# Altium schematic sheet POWER.SchDoc
size A4; SheetNumber: 2; SheetTotal: 4
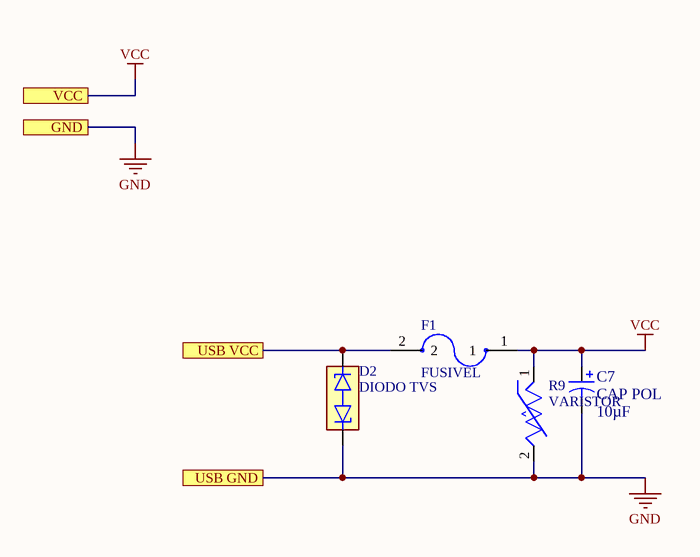
[diagram p0: POWER.SchDoc]

## Parts
C7  CAP POL  value 10µF  [CONDENS 10uF]
D2  DIODO TVS  [DIODO TVS]
F1  FUSIVEL  [FUSIVEL ARMADO 0.5A]
R9  VARISTOR  [VARISTOR]

## Ports
GND, USB GND, USB VCC, VCC

## Nets
GND: C7.2 D2.1 R9.2 ; port GND, port USB GND
VCC: C7.1 F1.1 R9.1 ; port VCC
USB VCC: D2.2 F1.2 ; port USB VCC

## Library data of the parts
C7 = Cap Pol2: Polarized Capacitor (Axial); Published: 8-Jun-2000; LatestRevisionDate: 17-Jul-2002; LatestRevisionNote: Re-released for DXP Platform.; PackageReference: POLAR0.8; Publisher: Altium Limited; PackageDescription: Polarized Capacitor; 2 Leads
D2 = DIODO TVS: 1 Amp General Purpose Rectifier; Published: 8-Jun-2000; LatestRevisionDate: 17-Jul-2002; LatestRevisionNote: Re-released for DXP Platform.; DatasheetVersion: 1998; PackageVersion: Aug-1999; PackageReference: DO-41; Publisher: Altium Limited; PackageDescription: Diode, Axial; Body 5.2 x 2.7 mm (LxDia. max), Lead Dia. 0.86 mm (max); Code_JEDEC: DO-204-AL; ComponentLink1Description: Manufacturer Link; ComponentLink1URL: http://www.fairchildsemi.com/; ComponentLink2Description: Datasheet; ComponentLink2URL: http://www.fairchildsemi.com/ds/1N%2F1N4001.pdf
F1 = FUSIVEL ARMADO 0.5A: Fuse; Published: 8-Jun-2000; LatestRevisionDate: 17-Jul-2002; LatestRevisionNote: Re-released for DXP Platform.; PackageReference: PIN-W2/E2.8; Publisher: Altium Limited; PackageDescription: Thru-Hole; 2 Leads
R9 = VARISTOR: Varistor (Voltage-Sensitive Resistor); Published: 24-Mar-1999; LatestRevisionDate: 29-May-2009; LatestRevisionNote: IPC-7351 Footprint Added.; PackageVersion: Mar-2003; PackageReference: 6-0805; Publisher: Altium Limited; PackageDescription: Chip Resistor 0805 Case Size; Code_IPC: RESC2012